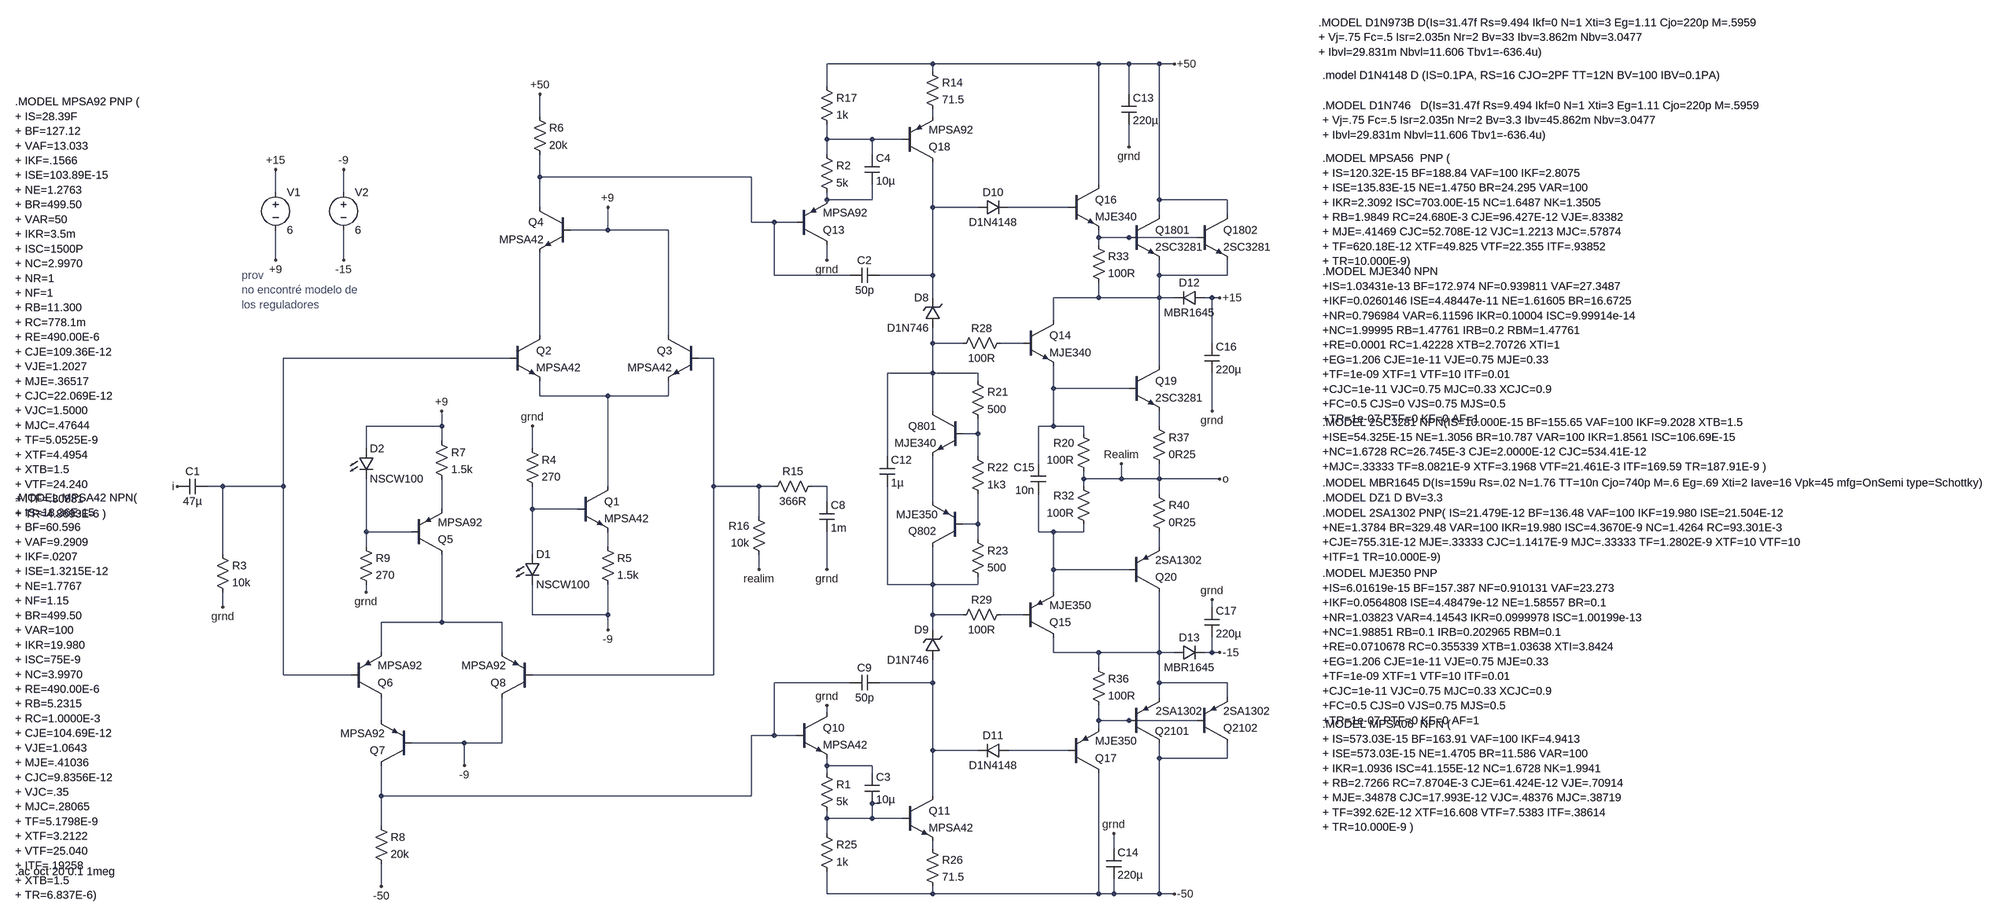
[diagram p0: schematic ss-ampli-g-2doInfAvance.asc]
ss-ampli-g-2doInfAvance.asc, the LTspice schematic file:
Version 4
SHEET 1 4608 680
WIRE 1680 -1584 1456 -1584
WIRE 2032 -1584 1680 -1584
WIRE 2096 -1584 2032 -1584
WIRE 2160 -1584 2096 -1584
WIRE 2192 -1584 2160 -1584
WIRE 1680 -1568 1680 -1584
WIRE 1456 -1536 1456 -1584
WIRE 2096 -1520 2096 -1584
WIRE 848 -1472 848 -1520
WIRE 1680 -1472 1680 -1488
WIRE 1456 -1424 1456 -1456
WIRE 1552 -1424 1456 -1424
WIRE 1616 -1424 1552 -1424
WIRE 2096 -1408 2096 -1456
WIRE 1456 -1392 1456 -1424
WIRE 1552 -1392 1552 -1424
WIRE 848 -1344 848 -1392
WIRE 1296 -1344 848 -1344
WIRE 2032 -1328 2032 -1584
WIRE 288 -1312 288 -1360
WIRE 432 -1312 432 -1360
WIRE 1456 -1296 1456 -1312
WIRE 1552 -1296 1552 -1328
WIRE 1552 -1296 1456 -1296
WIRE 2160 -1296 2160 -1584
WIRE 2304 -1296 2160 -1296
WIRE 848 -1280 848 -1344
WIRE 1680 -1280 1680 -1376
WIRE 1776 -1280 1680 -1280
WIRE 1968 -1280 1840 -1280
WIRE 2160 -1264 2160 -1296
WIRE 2304 -1264 2304 -1296
WIRE 1296 -1248 1296 -1344
WIRE 1344 -1248 1296 -1248
WIRE 1392 -1248 1344 -1248
WIRE 992 -1232 992 -1280
WIRE 992 -1232 912 -1232
WIRE 1120 -1232 992 -1232
WIRE 2032 -1216 2032 -1232
WIRE 2096 -1216 2032 -1216
WIRE 2240 -1216 2096 -1216
WIRE 2032 -1200 2032 -1216
WIRE 288 -1168 288 -1232
WIRE 432 -1168 432 -1232
WIRE 1456 -1168 1456 -1200
WIRE 1344 -1136 1344 -1248
WIRE 1504 -1136 1344 -1136
WIRE 1680 -1136 1680 -1280
WIRE 1680 -1136 1568 -1136
WIRE 2160 -1136 2160 -1168
WIRE 2304 -1136 2304 -1168
WIRE 2304 -1136 2160 -1136
WIRE 1680 -1088 1680 -1136
WIRE 2032 -1088 2032 -1120
WIRE 2032 -1088 1936 -1088
WIRE 2160 -1088 2160 -1136
WIRE 2160 -1088 2032 -1088
WIRE 2192 -1088 2160 -1088
WIRE 2272 -1088 2256 -1088
WIRE 2288 -1088 2272 -1088
WIRE 1936 -1040 1936 -1088
WIRE 848 -1008 848 -1184
WIRE 1120 -1008 1120 -1232
WIRE 1680 -992 1680 -1024
WIRE 1744 -992 1680 -992
WIRE 1872 -992 1824 -992
WIRE 2272 -992 2272 -1088
WIRE 784 -960 304 -960
WIRE 1216 -960 1184 -960
WIRE 2160 -944 2160 -1088
WIRE 1680 -928 1680 -992
WIRE 1680 -928 1584 -928
WIRE 1776 -928 1680 -928
WIRE 1776 -912 1776 -928
WIRE 1936 -896 1936 -944
WIRE 2096 -896 1936 -896
WIRE 848 -880 848 -912
WIRE 992 -880 848 -880
WIRE 1120 -880 1120 -912
WIRE 1120 -880 992 -880
WIRE 1680 -848 1680 -928
WIRE 2272 -848 2272 -928
WIRE 640 -816 640 -848
WIRE 640 -816 480 -816
WIRE 1936 -816 1936 -896
WIRE 1936 -816 1904 -816
WIRE 2000 -816 1936 -816
WIRE 2160 -816 2160 -848
WIRE 1776 -800 1776 -832
WIRE 1776 -800 1744 -800
WIRE 2000 -800 2000 -816
WIRE 640 -784 640 -816
WIRE 480 -768 480 -816
WIRE 832 -768 832 -816
WIRE 1584 -752 1584 -928
WIRE 1776 -752 1776 -800
WIRE 1904 -736 1904 -816
WIRE 2000 -704 2000 -720
WIRE 2080 -704 2080 -736
WIRE 2080 -704 2000 -704
WIRE 2160 -704 2160 -736
WIRE 2160 -704 2080 -704
WIRE 2288 -704 2160 -704
WIRE 176 -688 144 -688
WIRE 304 -688 304 -960
WIRE 304 -688 176 -688
WIRE 992 -688 992 -880
WIRE 1216 -688 1216 -960
WIRE 1312 -688 1216 -688
WIRE 1344 -688 1312 -688
WIRE 1456 -688 1424 -688
WIRE 2000 -688 2000 -704
WIRE 2160 -672 2160 -704
WIRE 1456 -656 1456 -688
WIRE 1680 -656 1680 -752
WIRE 640 -640 640 -704
WIRE 832 -640 832 -688
WIRE 928 -640 832 -640
WIRE 1312 -624 1312 -688
WIRE 1776 -608 1776 -672
WIRE 1776 -608 1744 -608
WIRE 480 -592 480 -704
WIRE 576 -592 480 -592
WIRE 1904 -592 1904 -672
WIRE 1936 -592 1904 -592
WIRE 2000 -592 2000 -608
WIRE 2000 -592 1936 -592
WIRE 1776 -576 1776 -608
WIRE 480 -560 480 -592
WIRE 992 -560 992 -592
WIRE 2160 -560 2160 -592
WIRE 176 -544 176 -688
WIRE 832 -544 832 -640
WIRE 1312 -512 1312 -544
WIRE 1456 -512 1456 -592
WIRE 1936 -512 1936 -592
WIRE 2096 -512 1936 -512
WIRE 1584 -480 1584 -688
WIRE 1680 -480 1680 -560
WIRE 1680 -480 1584 -480
WIRE 1776 -480 1776 -496
WIRE 1776 -480 1680 -480
WIRE 480 -464 480 -480
WIRE 1936 -464 1936 -512
WIRE 176 -432 176 -464
WIRE 2272 -432 2272 -448
WIRE 832 -416 832 -480
WIRE 992 -416 992 -480
WIRE 992 -416 832 -416
WIRE 1680 -416 1680 -480
WIRE 1744 -416 1680 -416
WIRE 1872 -416 1824 -416
WIRE 640 -400 640 -544
WIRE 640 -400 512 -400
WIRE 768 -400 640 -400
WIRE 992 -384 992 -416
WIRE 1680 -384 1680 -416
WIRE 512 -336 512 -400
WIRE 768 -336 768 -400
WIRE 1936 -336 1936 -368
WIRE 2032 -336 1936 -336
WIRE 2160 -336 2160 -464
WIRE 2160 -336 2032 -336
WIRE 2192 -336 2160 -336
WIRE 2272 -336 2272 -368
WIRE 2272 -336 2256 -336
WIRE 2288 -336 2272 -336
WIRE 2032 -304 2032 -336
WIRE 304 -288 304 -688
WIRE 448 -288 304 -288
WIRE 1216 -288 1216 -688
WIRE 1216 -288 832 -288
WIRE 1504 -272 1344 -272
WIRE 1680 -272 1680 -320
WIRE 1680 -272 1568 -272
WIRE 2160 -272 2160 -336
WIRE 2304 -272 2160 -272
WIRE 2160 -240 2160 -272
WIRE 2304 -240 2304 -272
WIRE 1456 -208 1456 -224
WIRE 512 -192 512 -240
WIRE 2032 -192 2032 -224
WIRE 2096 -192 2032 -192
WIRE 2240 -192 2096 -192
WIRE 2032 -176 2032 -192
WIRE 1344 -160 1344 -272
WIRE 1344 -160 1296 -160
WIRE 1392 -160 1344 -160
WIRE 688 -144 576 -144
WIRE 768 -144 768 -240
WIRE 768 -144 688 -144
WIRE 1680 -128 1680 -272
WIRE 1776 -128 1680 -128
WIRE 1968 -128 1840 -128
WIRE 2160 -112 2160 -144
WIRE 2304 -112 2304 -144
WIRE 2304 -112 2160 -112
WIRE 688 -96 688 -144
WIRE 1456 -96 1456 -112
WIRE 1552 -96 1456 -96
WIRE 1456 -80 1456 -96
WIRE 1552 -80 1552 -96
WIRE 512 -32 512 -96
WIRE 1296 -32 1296 -160
WIRE 1296 -32 512 -32
WIRE 1680 -32 1680 -128
WIRE 1568 -16 1552 -16
WIRE 1456 16 1456 0
WIRE 1552 16 1552 -16
WIRE 1552 16 1456 16
WIRE 1616 16 1552 16
WIRE 512 32 512 -32
WIRE 1456 48 1456 16
WIRE 1680 80 1680 64
WIRE 2064 80 2064 48
WIRE 512 160 512 112
WIRE 1456 176 1456 128
WIRE 1680 176 1680 160
WIRE 1680 176 1456 176
WIRE 2032 176 2032 -80
WIRE 2032 176 1680 176
WIRE 2064 176 2064 144
WIRE 2064 176 2032 176
WIRE 2160 176 2160 -112
WIRE 2160 176 2064 176
WIRE 2192 176 2160 176
FLAG 2192 176 -50
FLAG 2288 -336 -15
FLAG 2192 -1584 +50
FLAG 2288 -1088 +15
FLAG 1312 -512 realim
FLAG 2080 -736 Realim
FLAG 80 -688 i
FLAG 2288 -704 o
FLAG 288 -1168 +9
FLAG 288 -1360 +15
FLAG 432 -1360 -9
FLAG 432 -1168 -15
FLAG 992 -1280 +9
FLAG 992 -384 -9
FLAG 848 -1520 +50
FLAG 640 -848 +9
FLAG 688 -96 -9
FLAG 512 160 -50
FLAG 480 -464 grnd
FLAG 176 -432 grnd
FLAG 832 -816 grnd
FLAG 1456 -512 grnd
FLAG 1456 -224 grnd
FLAG 1456 -1168 grnd
FLAG 2096 -1408 grnd
FLAG 2272 -848 grnd
FLAG 2272 -448 grnd
FLAG 2064 48 grnd
SYMBOL npn 2096 -1264 R0
SYMATTR InstName Q1801
SYMATTR Value 2SC3281
SYMBOL npn 1968 -1328 R0
SYMATTR InstName Q16
SYMATTR Value MJE340
SYMBOL res 2016 -1216 R0
SYMATTR InstName R33
SYMATTR Value 100R
SYMBOL diode 2256 -1072 M270
WINDOW 0 32 32 VTop 2
WINDOW 3 0 32 VBottom 2
SYMATTR InstName D12
SYMATTR Value MBR1645
SYMBOL diode 1776 -1264 R270
WINDOW 0 32 32 VTop 2
WINDOW 3 0 32 VBottom 2
SYMATTR InstName D10
SYMATTR Value D1N4148
SYMBOL zener 1696 -1024 R180
WINDOW 0 24 64 Left 2
WINDOW 3 24 0 Left 2
SYMATTR InstName D8
SYMATTR Value D1N746
SYMBOL npn 1872 -1040 R0
SYMATTR InstName Q14
SYMATTR Value MJE340
SYMBOL npn 2096 -944 R0
SYMATTR InstName Q19
SYMATTR Value 2SC3281
SYMBOL res 2144 -832 R0
SYMATTR InstName R37
SYMATTR Value 0R25
SYMBOL res 2016 -704 R180
WINDOW 0 36 76 Left 2
WINDOW 3 36 40 Left 2
SYMATTR InstName R20
SYMATTR Value 100R
SYMBOL res 2144 -688 R0
SYMATTR InstName R40
SYMATTR Value 0R25
SYMBOL pnp 2096 -464 M180
SYMATTR InstName Q20
SYMATTR Value 2SA1302
SYMBOL pnp 1872 -368 M180
SYMATTR InstName Q15
SYMATTR Value MJE350
SYMBOL pnp 2096 -144 M180
WINDOW 0 55 25 Left 2
WINDOW 3 57 68 Left 2
SYMATTR InstName Q2101
SYMATTR Value 2SA1302
SYMBOL pnp 1968 -80 M180
SYMATTR InstName Q17
SYMATTR Value MJE350
SYMBOL res 2016 -320 R0
SYMATTR InstName R36
SYMATTR Value 100R
SYMBOL zener 1696 -320 R180
WINDOW 0 24 64 Left 2
WINDOW 3 24 0 Left 2
SYMATTR InstName D9
SYMATTR Value D1N746
SYMBOL diode 1840 -144 R90
WINDOW 0 0 32 VBottom 2
WINDOW 3 32 32 VTop 2
SYMATTR InstName D11
SYMATTR Value D1N4148
SYMBOL diode 2192 -320 R270
WINDOW 0 32 32 VTop 2
WINDOW 3 0 32 VBottom 2
SYMATTR InstName D13
SYMATTR Value MBR1645
SYMBOL res 1840 -1008 R90
WINDOW 0 0 56 VBottom 2
WINDOW 3 32 56 VTop 2
SYMATTR InstName R28
SYMATTR Value 100R
SYMBOL res 1840 -432 R90
WINDOW 0 0 56 VBottom 2
WINDOW 3 32 56 VTop 2
SYMATTR InstName R29
SYMATTR Value 100R
SYMBOL npn 1744 -848 M0
SYMATTR InstName Q801
SYMATTR Value MJE340
SYMBOL pnp 1744 -560 R180
WINDOW 0 56 33 Left 2
WINDOW 3 53 68 Left 2
SYMATTR InstName Q802
SYMATTR Value MJE350
SYMBOL res 1760 -928 R0
SYMATTR InstName R21
SYMATTR Value 500
SYMBOL res 1760 -768 R0
SYMATTR InstName R22
SYMATTR Value 1k3
SYMBOL res 1760 -592 R0
SYMATTR InstName R23
SYMATTR Value 500
SYMBOL npn 1616 -32 R0
SYMATTR InstName Q11
SYMATTR Value MPSA42
SYMBOL res 1664 64 R0
SYMATTR InstName R26
SYMATTR Value 71.5
SYMBOL npn 1392 -208 R0
SYMATTR InstName Q10
SYMATTR Value MPSA42
SYMBOL res 1440 32 R0
SYMATTR InstName R25
SYMATTR Value 1k
SYMBOL res 2016 -592 R180
WINDOW 0 36 76 Left 2
WINDOW 3 36 40 Left 2
SYMATTR InstName R32
SYMATTR Value 100R
SYMBOL res 1328 -672 R270
WINDOW 0 32 56 VTop 2
WINDOW 3 0 56 VBottom 2
SYMATTR InstName R15
SYMATTR Value 366R
SYMBOL res 1328 -528 R180
WINDOW 0 36 76 Left 2
WINDOW 3 36 40 Left 2
SYMATTR InstName R16
SYMATTR Value 10k
SYMBOL res 160 -560 R0
SYMATTR InstName R3
SYMATTR Value 10k
SYMBOL cap 1440 -656 R0
SYMATTR InstName C8
SYMATTR Value 1m
SYMBOL cap 144 -704 R90
WINDOW 0 0 32 VBottom 2
WINDOW 3 32 32 VTop 2
SYMATTR InstName C1
SYMATTR Value 47µ
SYMBOL cap 1568 -288 R90
WINDOW 0 0 32 VBottom 2
WINDOW 3 32 32 VTop 2
SYMATTR InstName C9
SYMATTR Value 50p
SYMBOL cap 1568 -752 R0
SYMATTR InstName C12
SYMATTR Value 1µ
SYMBOL cap 1920 -672 R180
WINDOW 0 24 56 Left 2
WINDOW 3 24 8 Left 2
SYMATTR InstName C15
SYMATTR Value 10n
SYMBOL npn 2240 -1264 R0
SYMATTR InstName Q1802
SYMATTR Value 2SC3281
SYMBOL pnp 2240 -144 M180
SYMATTR InstName Q2102
SYMATTR Value 2SA1302
SYMBOL cap 2048 80 R0
SYMATTR InstName C14
SYMATTR Value 220µ
SYMBOL cap 2256 -992 R0
SYMATTR InstName C16
SYMATTR Value 220µ
SYMBOL cap 2256 -432 R0
SYMATTR InstName C17
SYMATTR Value 220µ
SYMBOL cap 2080 -1520 R0
SYMATTR InstName C13
SYMATTR Value 220µ
SYMBOL pnp 1392 -1200 M180
SYMATTR InstName Q13
SYMATTR Value MPSA92
SYMBOL pnp 1616 -1376 M180
SYMATTR InstName Q18
SYMATTR Value MPSA92
SYMBOL cap 1568 -1152 R90
WINDOW 0 0 32 VBottom 2
WINDOW 3 32 32 VTop 2
SYMATTR InstName C2
SYMATTR Value 50p
SYMBOL res 1664 -1584 R0
SYMATTR InstName R14
SYMATTR Value 71.5
SYMBOL res 1440 -1552 R0
SYMATTR InstName R17
SYMATTR Value 1k
SYMBOL voltage 288 -1328 R0
WINDOW 123 0 0 Left 2
WINDOW 39 0 0 Left 2
SYMATTR InstName V1
SYMATTR Value 6
SYMBOL voltage 432 -1328 R0
WINDOW 123 0 0 Left 2
WINDOW 39 0 0 Left 2
SYMATTR InstName V2
SYMATTR Value 6
SYMBOL res 1440 -96 R0
SYMATTR InstName R1
SYMATTR Value 5k
SYMBOL cap 1536 -80 R0
SYMATTR InstName C3
SYMATTR Value 10µ
SYMBOL res 1440 -1408 R0
SYMATTR InstName R2
SYMATTR Value 5k
SYMBOL cap 1536 -1392 R0
SYMATTR InstName C4
SYMATTR Value 10µ
SYMBOL npn 928 -688 R0
SYMATTR InstName Q1
SYMATTR Value MPSA42
SYMBOL npn 784 -1008 R0
SYMATTR InstName Q2
SYMATTR Value MPSA42
SYMBOL npn 1184 -1008 M0
SYMATTR InstName Q3
SYMATTR Value MPSA42
SYMBOL res 816 -784 R0
SYMATTR InstName R4
SYMATTR Value 270
SYMBOL res 976 -576 R0
SYMATTR InstName R5
SYMATTR Value 1.5k
SYMBOL LED 816 -544 R0
SYMATTR InstName D1
SYMATTR Value NSCW100
SYMBOL res 832 -1488 R0
SYMATTR InstName R6
SYMATTR Value 20k
SYMBOL npn 912 -1280 M0
SYMATTR InstName Q4
SYMATTR Value MPSA42
SYMBOL res 624 -800 R0
SYMATTR InstName R7
SYMATTR Value 1.5k
SYMBOL pnp 576 -544 M180
SYMATTR InstName Q5
SYMATTR Value MPSA92
SYMBOL pnp 448 -240 M180
SYMATTR InstName Q6
SYMATTR Value MPSA92
SYMBOL pnp 576 -96 R180
SYMATTR InstName Q7
SYMATTR Value MPSA92
SYMBOL res 496 16 R0
SYMATTR InstName R8
SYMATTR Value 20k
SYMBOL pnp 832 -240 R180
SYMATTR InstName Q8
SYMATTR Value MPSA92
SYMBOL LED 464 -768 R0
SYMATTR InstName D2
SYMATTR Value NSCW100
SYMBOL res 464 -576 R0
SYMATTR InstName R9
SYMATTR Value 270
TEXT 2616 -664 Left 2 !.MODEL DZ1 D BV=3.3
TEXT 2616 -1384 Left 2 !.MODEL MPSA56  PNP (\n+ IS=120.32E-15 BF=188.84 VAF=100 IKF=2.8075\n+ ISE=135.83E-15 NE=1.4750 BR=24.295 VAR=100\n+ IKR=2.3092 ISC=703.00E-15 NC=1.6487 NK=1.3505\n+ RB=1.9849 RC=24.680E-3 CJE=96.427E-12 VJE=.83382\n+ MJE=.41469 CJC=52.708E-12 VJC=1.2213 MJC=.57874\n+ TF=620.18E-12 XTF=49.825 VTF=22.355 ITF=.93852\n+ TR=10.000E-9)
TEXT 2616 -1144 Left 2 !.MODEL MJE340 NPN\n+IS=1.03431e-13 BF=172.974 NF=0.939811 VAF=27.3487\n+IKF=0.0260146 ISE=4.48447e-11 NE=1.61605 BR=16.6725\n+NR=0.796984 VAR=6.11596 IKR=0.10004 ISC=9.99914e-14\n+NC=1.99995 RB=1.47761 IRB=0.2 RBM=1.47761\n+RE=0.0001 RC=1.42228 XTB=2.70726 XTI=1\n+EG=1.206 CJE=1e-11 VJE=0.75 MJE=0.33\n+TF=1e-09 XTF=1 VTF=10 ITF=0.01\n+CJC=1e-11 VJC=0.75 MJC=0.33 XCJC=0.9\n+FC=0.5 CJS=0 VJS=0.75 MJS=0.5\n+TR=1e-07 PTF=0 KF=0 AF=1
TEXT 2616 -824 Left 2 !.MODEL 2SC3281 NPN(IS=10.000E-15 BF=155.65 VAF=100 IKF=9.2028 XTB=1.5\n+ISE=54.325E-15 NE=1.3056 BR=10.787 VAR=100 IKR=1.8561 ISC=106.69E-15\n+NC=1.6728 RC=26.745E-3 CJE=2.0000E-12 CJC=534.41E-12\n+MJC=.33333 TF=8.0821E-9 XTF=3.1968 VTF=21.461E-3 ITF=169.59 TR=187.91E-9 )
TEXT 2616 -696 Left 2 !.MODEL MBR1645 D(Is=159u Rs=.02 N=1.76 TT=10n Cjo=740p M=.6 Eg=.69 Xti=2 Iave=16 Vpk=45 mfg=OnSemi type=Schottky)
TEXT 2616 -632 Left 2 !.MODEL 2SA1302 PNP( IS=21.479E-12 BF=136.48 VAF=100 IKF=19.980 ISE=21.504E-12\n+NE=1.3784 BR=329.48 VAR=100 IKR=19.980 ISC=4.3670E-9 NC=1.4264 RC=93.301E-3\n+CJE=755.31E-12 MJE=.33333 CJC=1.1417E-9 MJC=.33333 TF=1.2802E-9 XTF=10 VTF=10\n+ITF=1 TR=10.000E-9)
TEXT 2616 -504 Left 2 !.MODEL MJE350 PNP\n+IS=6.01619e-15 BF=157.387 NF=0.910131 VAF=23.273\n+IKF=0.0564808 ISE=4.48479e-12 NE=1.58557 BR=0.1\n+NR=1.03823 VAR=4.14543 IKR=0.0999978 ISC=1.00199e-13\n+NC=1.98851 RB=0.1 IRB=0.202965 RBM=0.1\n+RE=0.0710678 RC=0.355339 XTB=1.03638 XTI=3.8424\n+EG=1.206 CJE=1e-11 VJE=0.75 MJE=0.33\n+TF=1e-09 XTF=1 VTF=10 ITF=0.01\n+CJC=1e-11 VJC=0.75 MJC=0.33 XCJC=0.9\n+FC=0.5 CJS=0 VJS=0.75 MJS=0.5\n+TR=1e-07 PTF=0 KF=0 AF=1
TEXT 2616 -184 Left 2 !.MODEL MPSA06  NPN (\n+ IS=573.03E-15 BF=163.91 VAF=100 IKF=4.9413\n+ ISE=573.03E-15 NE=1.4705 BR=11.586 VAR=100\n+ IKR=1.0936 ISC=41.155E-12 NC=1.6728 NK=1.9941\n+ RB=2.7266 RC=7.8704E-3 CJE=61.424E-12 VJE=.70914\n+ MJE=.34878 CJC=17.993E-12 VJC=.48376 MJC=.38719\n+ TF=392.62E-12 XTF=16.608 VTF=7.5383 ITF=.38614\n+ TR=10.000E-9 )
TEXT 2616 -1496 Left 2 !.MODEL D1N746   D(Is=31.47f Rs=9.494 Ikf=0 N=1 Xti=3 Eg=1.11 Cjo=220p M=.5959\n+ Vj=.75 Fc=.5 Isr=2.035n Nr=2 Bv=3.3 Ibv=45.862m Nbv=3.0477\n+ Ibvl=29.831m Nbvl=11.606 Tbv1=-636.4u)
TEXT 2616 -1560 Left 2 !.model D1N4148 D (IS=0.1PA, RS=16 CJO=2PF TT=12N BV=100 IBV=0.1PA)
TEXT -264 -1504 Left 2 !.MODEL MPSA92 PNP (\n+ IS=28.39F\n+ BF=127.12\n+ VAF=13.033\n+ IKF=.1566\n+ ISE=103.89E-15\n+ NE=1.2763\n+ BR=499.50\n+ VAR=50\n+ IKR=3.5m\n+ ISC=1500P\n+ NC=2.9970\n+ NR=1\n+ NF=1\n+ RB=11.300\n+ RC=778.1m\n+ RE=490.00E-6\n+ CJE=109.36E-12\n+ VJE=1.2027\n+ MJE=.36517\n+ CJC=22.069E-12\n+ VJC=1.5000\n+ MJC=.47644\n+ TF=5.0525E-9\n+ XTF=4.4954\n+ XTB=1.5\n+ VTF=24.240\n+ ITF=.30881\n+ TR=4.8693E-6 )
TEXT -264 -664 Left 2 !.MODEL MPSA42 NPN(\n+ IS=18.36E-15\n+ BF=60.596\n+ VAF=9.2909\n+ IKF=.0207\n+ ISE=1.3215E-12\n+ NE=1.7767\n+ NF=1.15\n+ BR=499.50\n+ VAR=100\n+ IKR=19.980\n+ ISC=75E-9\n+ NC=3.9970\n+ RE=490.00E-6\n+ RB=5.2315\n+ RC=1.0000E-3\n+ CJE=104.69E-12\n+ VJE=1.0643\n+ MJE=.41036\n+ CJC=9.8356E-12\n+ VJC=.35\n+ MJC=.28065\n+ TF=5.1798E-9\n+ XTF=3.2122\n+ VTF=25.040\n+ ITF=.19258\n+ XTB=1.5\n+ TR=6.837E-6)
TEXT 2608 -1672 Left 2 !.MODEL D1N973B D(Is=31.47f Rs=9.494 Ikf=0 N=1 Xti=3 Eg=1.11 Cjo=220p M=.5959\n+ Vj=.75 Fc=.5 Isr=2.035n Nr=2 Bv=33 Ibv=3.862m Nbv=3.0477\n+ Ibvl=29.831m Nbvl=11.606 Tbv1=-636.4u)
TEXT -264 128 Left 2 !.ac oct 20 0.1 1meg
TEXT 216 -1136 Left 2 ;prov\nno encontré modelo de\nlos reguladores

The netlist it stands for:
* ss-ampli-g-2doInfAvance.asc
Q1801 +50 N007 N008 0 2SC3281
Q16 +50 N006 N007 0 MJE340
R33 N007 N008 100R
D12 +15 N008 MBR1645
D10 N005 N006 D1N4148
D8 N010 N005 D1N746
Q14 N008 N011 N014 0 MJE340
Q19 N008 N014 N016 0 2SC3281
R37 N016 o 0R25
R20 o N014 100R
R40 o N026 0R25
Q20 N030 N024 N026 0 2SA1302
Q15 N030 N028 N024 0 MJE350
Q2101 -50 N034 N030 0 2SA1302
Q17 -50 N035 N034 0 MJE350
R36 N030 N034 100R
D9 N032 N027 D1N746
D11 N035 N032 D1N4148
D13 N030 -15 MBR1645
R28 N011 N010 100R
R29 N028 N027 100R
Q801 N010 N017 N019 0 MJE340
Q802 N027 N022 N019 0 MJE350
R21 N010 N017 500
R22 N017 N022 1k3
R23 N022 N027 500
Q11 N032 N037 N038 0 MPSA42
R26 N038 -50 71.5
Q10 grnd N031 N036 0 MPSA42
R25 N037 -50 1k
R32 N024 o 100R
R15 N013 N018 366R
R16 o N013 10k
R3 N012 grnd 10k
C8 N018 grnd 1m
C1 N012 i 47µ
C9 N032 N031 50p
C12 N010 N027 1µ
C15 N024 N014 10n
Q1802 +50 N007 N008 0 2SC3281
Q2102 -50 N034 N030 0 2SA1302
C14 grnd -50 220µ
C16 +15 grnd 220µ
C17 grnd -15 220µ
C13 +50 grnd 220µ
Q13 grnd N003 N004 0 MPSA92
Q18 N005 N002 N001 0 MPSA92
C2 N005 N003 50p
R14 +50 N001 71.5
R17 +50 N002 1k
V1 +15 +9 6
V2 -9 -15 6
R1 N036 N037 5k
C3 N036 N037 10µ
R2 N002 N004 5k
C4 N002 N004 10µ
Q1 N015 N021 N025 0 MPSA42
Q2 N009 N012 N015 0 MPSA42
Q3 +9 N013 N015 0 MPSA42
R4 grnd N021 270
R5 N025 -9 1.5k
D1 N021 -9 NSCW100
R6 +50 N003 20k
Q4 N003 +9 N009 0 MPSA42
R7 +9 N020 1.5k
Q5 N029 N023 N020 0 MPSA92
Q6 N033 N012 N029 0 MPSA92
Q7 N031 -9 N033 0 MPSA92
R8 N031 -50 20k
Q8 -9 N013 N029 0 MPSA92
D2 +9 N023 NSCW100
R9 N023 grnd 270
.model D D
.lib standard.dio
.model NPN NPN
.model PNP PNP
.lib standard.bjt
.MODEL DZ1 D BV=3.3
.MODEL MPSA56  PNP (
+ IS=120.32E-15 BF=188.84 VAF=100 IKF=2.8075
+ ISE=135.83E-15 NE=1.4750 BR=24.295 VAR=100
+ IKR=2.3092 ISC=703.00E-15 NC=1.6487 NK=1.3505
+ RB=1.9849 RC=24.680E-3 CJE=96.427E-12 VJE=.83382
+ MJE=.41469 CJC=52.708E-12 VJC=1.2213 MJC=.57874
+ TF=620.18E-12 XTF=49.825 VTF=22.355 ITF=.93852
+ TR=10.000E-9)
.MODEL MJE340 NPN
+IS=1.03431e-13 BF=172.974 NF=0.939811 VAF=27.3487
+IKF=0.0260146 ISE=4.48447e-11 NE=1.61605 BR=16.6725
+NR=0.796984 VAR=6.11596 IKR=0.10004 ISC=9.99914e-14
+NC=1.99995 RB=1.47761 IRB=0.2 RBM=1.47761
+RE=0.0001 RC=1.42228 XTB=2.70726 XTI=1
+EG=1.206 CJE=1e-11 VJE=0.75 MJE=0.33
+TF=1e-09 XTF=1 VTF=10 ITF=0.01
+CJC=1e-11 VJC=0.75 MJC=0.33 XCJC=0.9
+FC=0.5 CJS=0 VJS=0.75 MJS=0.5
+TR=1e-07 PTF=0 KF=0 AF=1
.MODEL 2SC3281 NPN(IS=10.000E-15 BF=155.65 VAF=100 IKF=9.2028 XTB=1.5
+ISE=54.325E-15 NE=1.3056 BR=10.787 VAR=100 IKR=1.8561 ISC=106.69E-15
+NC=1.6728 RC=26.745E-3 CJE=2.0000E-12 CJC=534.41E-12
+MJC=.33333 TF=8.0821E-9 XTF=3.1968 VTF=21.461E-3 ITF=169.59 TR=187.91E-9 )
.MODEL MBR1645 D(Is=159u Rs=.02 N=1.76 TT=10n Cjo=740p M=.6 Eg=.69 Xti=2 Iave=16 Vpk=45 mfg=OnSemi type=Schottky)
.MODEL 2SA1302 PNP( IS=21.479E-12 BF=136.48 VAF=100 IKF=19.980 ISE=21.504E-12
+NE=1.3784 BR=329.48 VAR=100 IKR=19.980 ISC=4.3670E-9 NC=1.4264 RC=93.301E-3
+CJE=755.31E-12 MJE=.33333 CJC=1.1417E-9 MJC=.33333 TF=1.2802E-9 XTF=10 VTF=10
+ITF=1 TR=10.000E-9)
.MODEL MJE350 PNP
+IS=6.01619e-15 BF=157.387 NF=0.910131 VAF=23.273
+IKF=0.0564808 ISE=4.48479e-12 NE=1.58557 BR=0.1
+NR=1.03823 VAR=4.14543 IKR=0.0999978 ISC=1.00199e-13
+NC=1.98851 RB=0.1 IRB=0.202965 RBM=0.1
+RE=0.0710678 RC=0.355339 XTB=1.03638 XTI=3.8424
+EG=1.206 CJE=1e-11 VJE=0.75 MJE=0.33
+TF=1e-09 XTF=1 VTF=10 ITF=0.01
+CJC=1e-11 VJC=0.75 MJC=0.33 XCJC=0.9
+FC=0.5 CJS=0 VJS=0.75 MJS=0.5
+TR=1e-07 PTF=0 KF=0 AF=1
.MODEL MPSA06  NPN (
+ IS=573.03E-15 BF=163.91 VAF=100 IKF=4.9413
+ ISE=573.03E-15 NE=1.4705 BR=11.586 VAR=100
+ IKR=1.0936 ISC=41.155E-12 NC=1.6728 NK=1.9941
+ RB=2.7266 RC=7.8704E-3 CJE=61.424E-12 VJE=.70914
+ MJE=.34878 CJC=17.993E-12 VJC=.48376 MJC=.38719
+ TF=392.62E-12 XTF=16.608 VTF=7.5383 ITF=.38614
+ TR=10.000E-9 )
.MODEL D1N746   D(Is=31.47f Rs=9.494 Ikf=0 N=1 Xti=3 Eg=1.11 Cjo=220p M=.5959
+ Vj=.75 Fc=.5 Isr=2.035n Nr=2 Bv=3.3 Ibv=45.862m Nbv=3.0477
+ Ibvl=29.831m Nbvl=11.606 Tbv1=-636.4u)
.model D1N4148 D (IS=0.1PA, RS=16 CJO=2PF TT=12N BV=100 IBV=0.1PA)
.MODEL MPSA92 PNP (
+ IS=28.39F
+ BF=127.12
+ VAF=13.033
+ IKF=.1566
+ ISE=103.89E-15
+ NE=1.2763
+ BR=499.50
+ VAR=50
+ IKR=3.5m
+ ISC=1500P
+ NC=2.9970
+ NR=1
+ NF=1
+ RB=11.300
+ RC=778.1m
+ RE=490.00E-6
+ CJE=109.36E-12
+ VJE=1.2027
+ MJE=.36517
+ CJC=22.069E-12
+ VJC=1.5000
+ MJC=.47644
+ TF=5.0525E-9
+ XTF=4.4954
+ XTB=1.5
+ VTF=24.240
+ ITF=.30881
+ TR=4.8693E-6 )
.MODEL MPSA42 NPN(
+ IS=18.36E-15
+ BF=60.596
+ VAF=9.2909
+ IKF=.0207
+ ISE=1.3215E-12
+ NE=1.7767
+ NF=1.15
+ BR=499.50
+ VAR=100
+ IKR=19.980
+ ISC=75E-9
+ NC=3.9970
+ RE=490.00E-6
+ RB=5.2315
+ RC=1.0000E-3
+ CJE=104.69E-12
+ VJE=1.0643
+ MJE=.41036
+ CJC=9.8356E-12
+ VJC=.35
+ MJC=.28065
+ TF=5.1798E-9
+ XTF=3.2122
+ VTF=25.040
+ ITF=.19258
+ XTB=1.5
+ TR=6.837E-6)
.MODEL D1N973B D(Is=31.47f Rs=9.494 Ikf=0 N=1 Xti=3 Eg=1.11 Cjo=220p M=.5959
+ Vj=.75 Fc=.5 Isr=2.035n Nr=2 Bv=33 Ibv=3.862m Nbv=3.0477
+ Ibvl=29.831m Nbvl=11.606 Tbv1=-636.4u)
.ac oct 20 0.1 1meg
* prov
* no encontré modelo de
* los reguladores
.backanno
.end